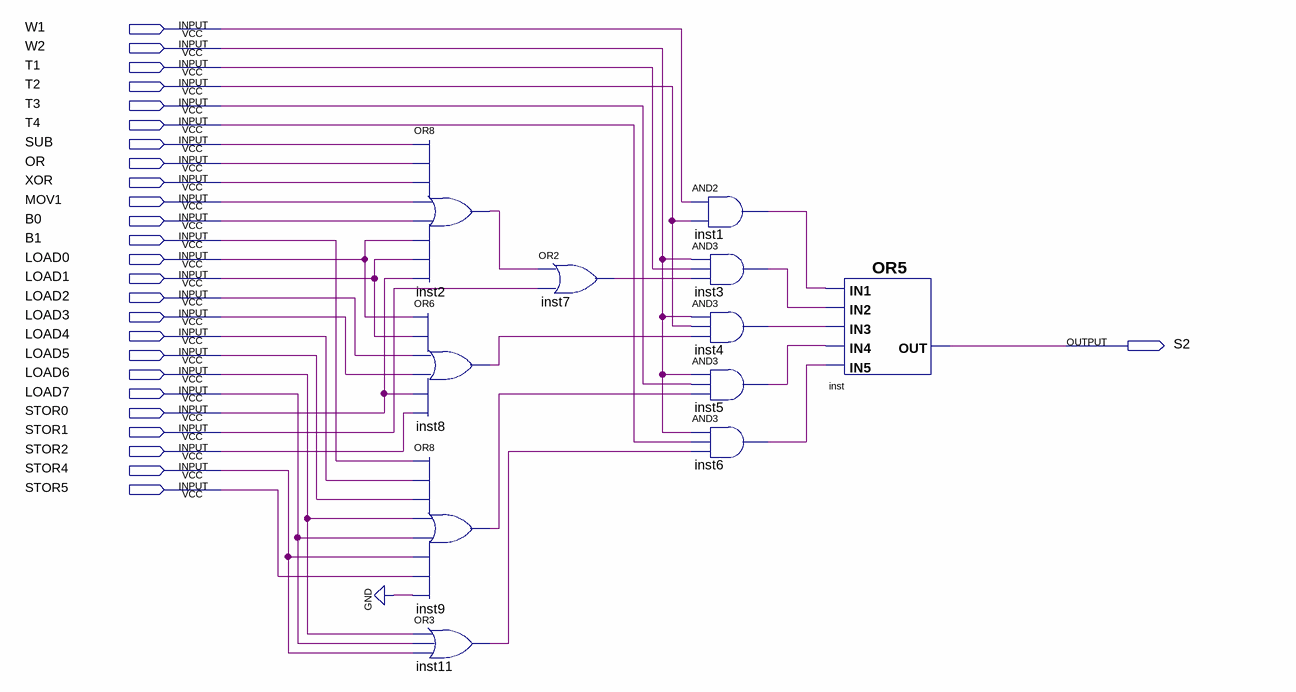
[diagram p0: schematic sheet]
// Quartus schematic S2.bdf as structural Verilog: 11 symbols, 26 pins
module S2 (
  input  W1,
  input  W2,
  input  T1,
  input  T2,
  input  T3,
  input  T4,
  input  SUB,
  input  OR,
  input  XOR,
  input  MOV1,
  input  B0,
  input  B1,
  input  LOAD0,
  input  LOAD1,
  input  LOAD2,
  input  LOAD3,
  input  LOAD4,
  input  LOAD5,
  input  LOAD6,
  input  LOAD7,
  input  STOR0,
  input  STOR1,
  input  STOR2,
  input  STOR4,
  input  STOR5,
  output S2
);

  wire inst1_out, inst2_out, inst3_out, inst4_out, inst5_out, inst6_out, inst7_out, inst8_out, inst9_out,
       inst11_out;

  or inst2 (inst2_out, SUB, OR, XOR, MOV1, B0, LOAD0, LOAD1, STOR0);
  or inst8 (inst8_out, LOAD0, LOAD1, LOAD2, LOAD3, STOR0, STOR2);
  or inst9 (inst9_out, B1, LOAD4, LOAD5, LOAD6, LOAD7, STOR4, STOR5, 1'b0);
  or inst11 (inst11_out, LOAD6, LOAD7, STOR4);
  or inst7 (inst7_out, inst2_out, STOR1);
  and inst1 (inst1_out, W1, T2);
  and inst3 (inst3_out, W2, T1, inst7_out);
  and inst4 (inst4_out, W2, T2, inst8_out);
  and inst5 (inst5_out, W2, T3, inst9_out);
  and inst6 (inst6_out, W2, T4, inst11_out);
  or inst (S2, inst1_out, inst3_out, inst4_out, inst5_out, inst6_out);
endmodule
